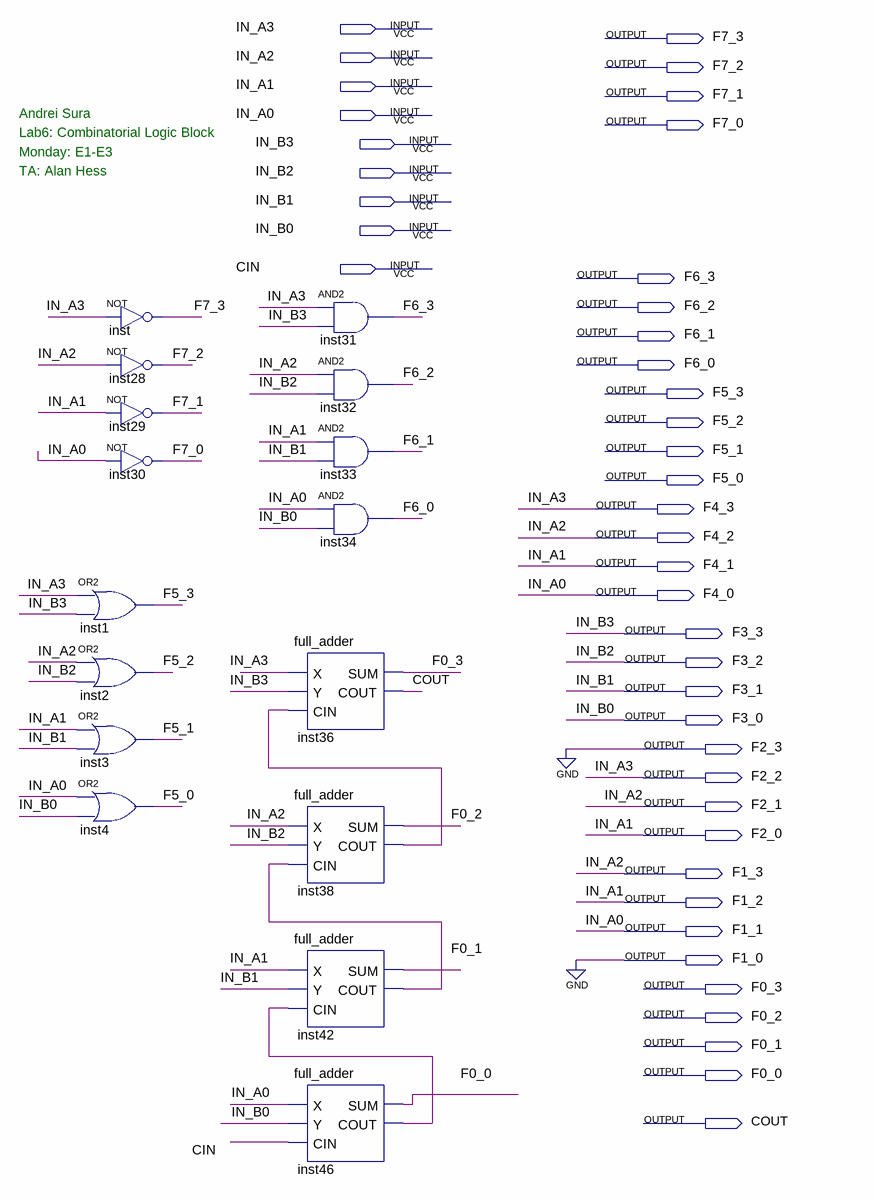
[diagram p0: schematic sheet]
// Quartus schematic comb_logic.bdf as structural Verilog: 16 symbols, 42 pins
module comb_logic (
  input  IN_A3,
  input  IN_A2,
  input  IN_A1,
  input  IN_A0,
  input  IN_B3,
  input  IN_B2,
  input  IN_B1,
  input  IN_B0,
  input  CIN,
  output F7_3,
  output F7_2,
  output F7_1,
  output F7_0,
  output F6_3,
  output F6_2,
  output F6_1,
  output F6_0,
  output F5_3,
  output F5_2,
  output F5_1,
  output F5_0,
  output F4_3,
  output F4_2,
  output F4_1,
  output F4_0,
  output F3_3,
  output F3_2,
  output F3_1,
  output F3_0,
  output F2_3,
  output F2_2,
  output F2_1,
  output F2_0,
  output F1_3,
  output F1_2,
  output F1_1,
  output F1_0,
  output F0_3,
  output F0_2,
  output F0_1,
  output F0_0,
  output COUT
);

  wire inst38_cout, inst42_cout, inst46_cout;

  or inst1 (F5_3, IN_A3, IN_B3);
  or inst2 (F5_2, IN_A2, IN_B2);
  or inst3 (F5_1, IN_A1, IN_B1);
  or inst4 (F5_0, IN_A0, IN_B0);
  not inst (F7_3, IN_A3);
  not inst28 (F7_2, IN_A2);
  not inst29 (F7_1, IN_A1);
  not inst30 (F7_0, IN_A0);
  full_adder inst36 (.X(IN_A3), .Y(IN_B3), .CIN(inst38_cout), .SUM(F0_3), .COUT(COUT));
  full_adder inst38 (.X(IN_A2), .Y(IN_B2), .CIN(inst42_cout), .SUM(F0_2), .COUT(inst38_cout));
  full_adder inst42 (.X(IN_A1), .Y(IN_B1), .CIN(inst46_cout), .SUM(F0_1), .COUT(inst42_cout));
  full_adder inst46 (.X(IN_A0), .Y(IN_B0), .CIN(CIN), .SUM(F0_0), .COUT(inst46_cout));
  and inst31 (F6_3, IN_A3, IN_B3);
  and inst32 (F6_2, IN_A2, IN_B2);
  and inst33 (F6_1, IN_A1, IN_B1);
  and inst34 (F6_0, IN_A0, IN_B0);

  assign F1_0 = 1'b0;
  assign F1_1 = IN_A0;
  assign F1_2 = IN_A1;
  assign F1_3 = IN_A2;
  assign F2_0 = IN_A1;
  assign F2_1 = IN_A2;
  assign F2_2 = IN_A3;
  assign F2_3 = 1'b0;
  assign F3_0 = IN_B0;
  assign F3_1 = IN_B1;
  assign F3_2 = IN_B2;
  assign F3_3 = IN_B3;
  assign F4_0 = IN_A0;
  assign F4_1 = IN_A1;
  assign F4_2 = IN_A2;
  assign F4_3 = IN_A3;

  // Notes on the sheet:
  //   Andrei Sura
  //   Lab6: Combinatorial Logic Block
  //   Monday: E1-E3
  //   TA: Alan Hess
endmodule
